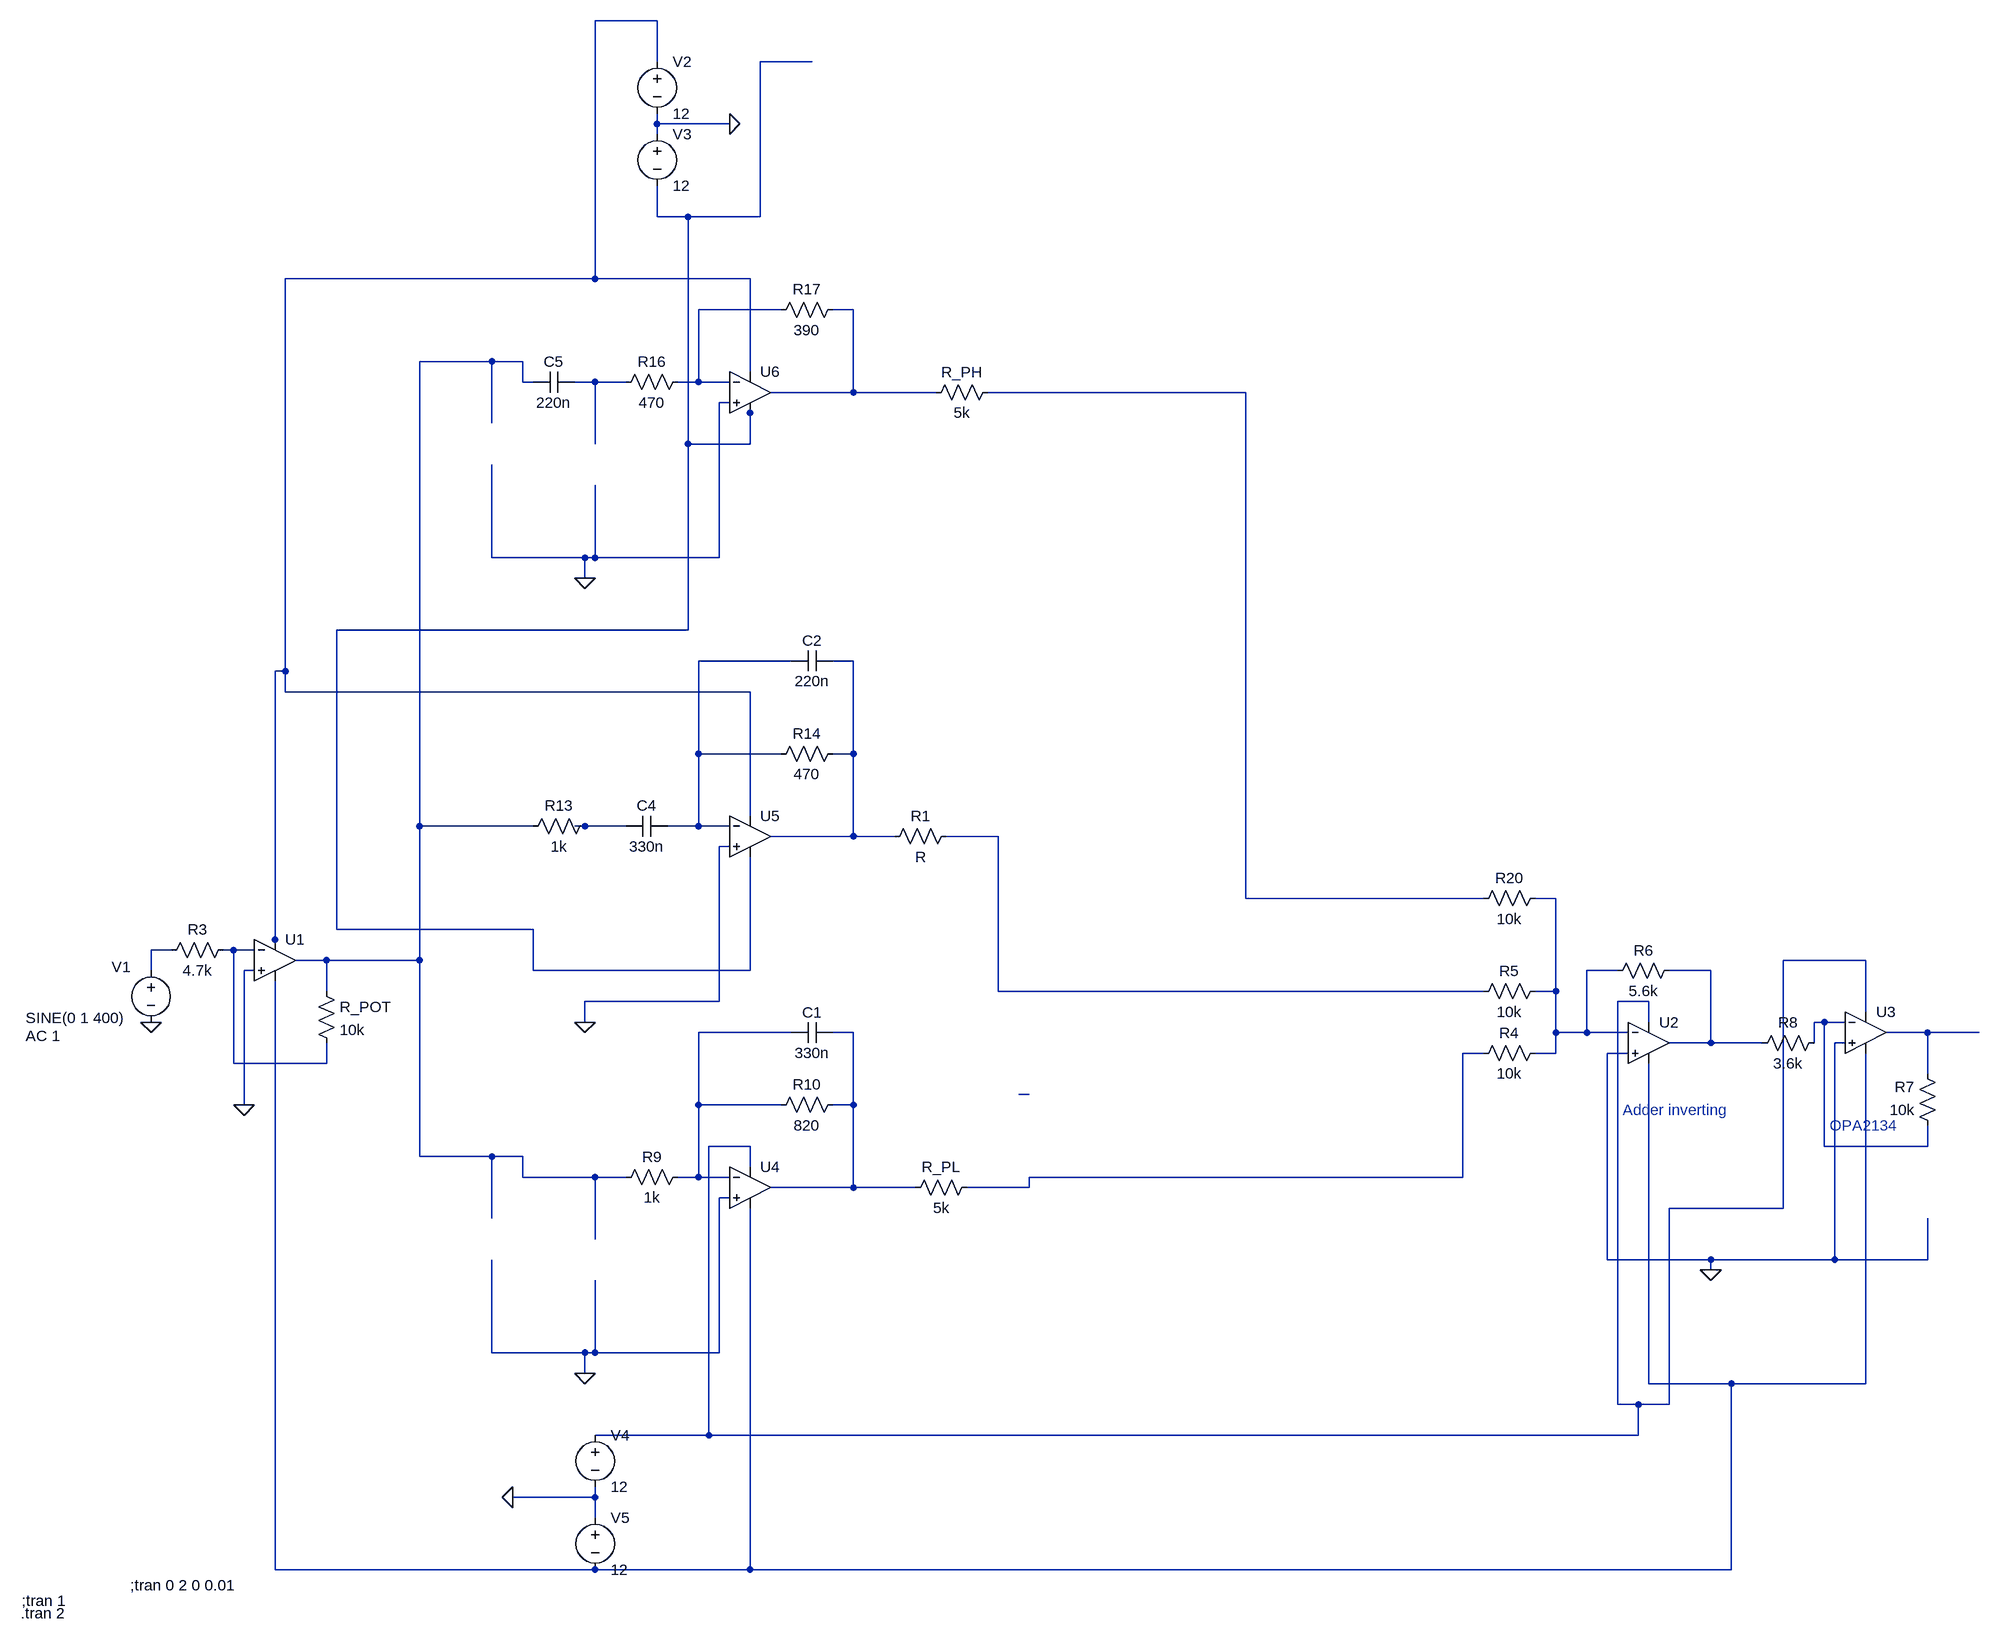
[diagram p0: schematic TheLastChanceBeforeSuicide.asc]
TheLastChanceBeforeSuicide.asc, the LTspice schematic file:
Version 4
SHEET 1 1940 1268
WIRE -112 -1216 -208 -1216
WIRE -112 -1152 -112 -1216
WIRE 128 -1152 48 -1152
WIRE -112 -1056 -112 -1072
WIRE 0 -1056 -112 -1056
WIRE -112 -1040 -112 -1056
WIRE -112 -912 -112 -960
WIRE -64 -912 -112 -912
WIRE 48 -912 48 -1152
WIRE 48 -912 -64 -912
WIRE -208 -816 -208 -1216
WIRE -208 -816 -688 -816
WIRE 32 -816 -208 -816
WIRE 80 -768 -48 -768
WIRE 192 -768 160 -768
WIRE -368 -688 -480 -688
WIRE -320 -688 -368 -688
WIRE 32 -672 32 -816
WIRE -320 -656 -320 -688
WIRE -304 -656 -320 -656
WIRE -208 -656 -240 -656
WIRE -160 -656 -208 -656
WIRE -48 -656 -48 -768
WIRE -48 -656 -80 -656
WIRE 0 -656 -48 -656
WIRE 192 -640 192 -768
WIRE 192 -640 64 -640
WIRE 320 -640 192 -640
WIRE 800 -640 400 -640
WIRE 0 -624 -16 -624
WIRE 32 -608 32 -624
WIRE -368 -592 -368 -688
WIRE -208 -560 -208 -656
WIRE -64 -560 -64 -912
WIRE 32 -560 32 -608
WIRE 32 -560 -64 -560
WIRE -368 -384 -368 -528
WIRE -224 -384 -368 -384
WIRE -208 -384 -208 -496
WIRE -208 -384 -224 -384
WIRE -16 -384 -16 -624
WIRE -16 -384 -208 -384
WIRE -224 -352 -224 -384
WIRE -64 -272 -64 -560
WIRE -64 -272 -608 -272
WIRE 96 -224 -48 -224
WIRE 192 -224 160 -224
WIRE -688 -208 -688 -816
WIRE -688 -208 -704 -208
WIRE -688 -176 -688 -208
WIRE 32 -176 -688 -176
WIRE -48 -80 -48 -224
WIRE 80 -80 -48 -80
WIRE 192 -80 192 -224
WIRE 192 -80 160 -80
WIRE 32 16 32 -176
WIRE -480 32 -480 -688
WIRE -304 32 -480 32
WIRE -224 32 -240 32
WIRE -160 32 -224 32
WIRE -48 32 -48 -80
WIRE -48 32 -96 32
WIRE 0 32 -48 32
WIRE 192 48 192 -80
WIRE 192 48 64 48
WIRE 256 48 192 48
WIRE 416 48 336 48
WIRE 0 64 -16 64
WIRE 800 144 800 -640
WIRE 1168 144 800 144
WIRE 1280 144 1248 144
WIRE -608 192 -608 -272
WIRE -304 192 -608 192
WIRE -704 208 -704 -208
WIRE -864 224 -896 224
WIRE -768 224 -784 224
WIRE -736 224 -768 224
WIRE -704 224 -704 208
WIRE -624 240 -672 240
WIRE -480 240 -480 32
WIRE -480 240 -624 240
WIRE 1760 240 1632 240
WIRE -896 256 -896 224
WIRE -736 256 -752 256
WIRE -304 256 -304 192
WIRE 32 256 32 80
WIRE 32 256 -304 256
WIRE 1376 256 1328 256
WIRE 1520 256 1456 256
WIRE -624 288 -624 240
WIRE 416 288 416 48
WIRE 1168 288 416 288
WIRE 1280 288 1280 144
WIRE 1280 288 1248 288
WIRE -16 304 -16 64
WIRE -16 304 -224 304
WIRE 1424 304 1376 304
WIRE 1760 320 1760 240
WIRE -224 336 -224 304
WIRE 1424 336 1424 304
WIRE 1696 336 1680 336
WIRE 1728 336 1696 336
WIRE 96 352 -48 352
WIRE 192 352 160 352
WIRE 1280 352 1280 288
WIRE 1328 352 1328 256
WIRE 1328 352 1280 352
WIRE 1392 352 1328 352
WIRE 1856 352 1792 352
WIRE 1936 352 1856 352
WIRE 1520 368 1520 256
WIRE 1520 368 1456 368
WIRE 1600 368 1520 368
WIRE 1680 368 1680 336
WIRE 1728 368 1712 368
WIRE 1168 384 1136 384
WIRE 1280 384 1280 352
WIRE 1280 384 1248 384
WIRE 1392 384 1360 384
WIRE -768 400 -768 224
WIRE -624 400 -624 368
WIRE -624 400 -768 400
WIRE 1856 416 1856 352
WIRE 464 448 448 448
WIRE -752 464 -752 256
WIRE -48 464 -48 352
WIRE 80 464 -48 464
WIRE 192 464 192 352
WIRE 192 464 160 464
WIRE 32 528 -32 528
WIRE 1696 528 1696 336
WIRE 1856 528 1856 496
WIRE 1856 528 1696 528
WIRE -480 544 -480 240
WIRE -368 544 -480 544
WIRE -320 544 -368 544
WIRE 32 560 32 528
WIRE -320 576 -320 544
WIRE -208 576 -320 576
WIRE -160 576 -208 576
WIRE -48 576 -48 464
WIRE -48 576 -80 576
WIRE 0 576 -48 576
WIRE 1136 576 1136 384
WIRE 1136 576 464 576
WIRE 192 592 192 464
WIRE 192 592 64 592
WIRE 288 592 192 592
WIRE 464 592 464 576
WIRE 464 592 368 592
WIRE 0 608 -16 608
WIRE 1632 624 1632 240
WIRE 1632 624 1456 624
WIRE -368 640 -368 544
WIRE -208 672 -208 576
WIRE 1360 704 1360 384
WIRE 1520 704 1360 704
WIRE 1712 704 1712 368
WIRE 1712 704 1520 704
WIRE 1856 704 1856 640
WIRE 1856 704 1712 704
WIRE 1520 720 1520 704
WIRE -368 848 -368 704
WIRE -224 848 -368 848
WIRE -208 848 -208 736
WIRE -208 848 -224 848
WIRE -16 848 -16 608
WIRE -16 848 -208 848
WIRE -224 880 -224 848
WIRE 1424 896 1424 400
WIRE 1552 896 1424 896
WIRE 1760 896 1760 384
WIRE 1760 896 1552 896
WIRE 1376 928 1376 304
WIRE 1408 928 1376 928
WIRE 1456 928 1456 624
WIRE 1456 928 1408 928
WIRE -32 976 -32 528
WIRE -32 976 -208 976
WIRE 1408 976 1408 928
WIRE 1408 976 -32 976
WIRE -208 1072 -208 1056
WIRE -208 1072 -336 1072
WIRE -208 1104 -208 1072
WIRE -704 1184 -704 272
WIRE -208 1184 -704 1184
WIRE 32 1184 32 624
WIRE 32 1184 -208 1184
WIRE 1552 1184 1552 896
WIRE 1552 1184 32 1184
FLAG -224 880 0
FLAG -896 336 0
FLAG 0 -1056 0
FLAG -336 1072 0
FLAG 1520 720 0
FLAG -224 336 0
FLAG -224 -352 0
FLAG -752 464 0
SYMBOL Opamps\\UniversalOpamp2 -704 240 R0
SYMATTR InstName U1
SYMBOL res -640 272 R0
SYMATTR InstName R_POT
SYMATTR Value 10k
SYMBOL res -768 208 R90
WINDOW 0 0 56 VBottom 2
WINDOW 3 32 56 VTop 2
SYMATTR InstName R3
SYMATTR Value 4.7k
SYMBOL voltage -896 240 R0
WINDOW 123 -194 117 Left 2
WINDOW 39 0 0 Left 2
WINDOW 0 -61 10 Left 2
WINDOW 3 -194 89 Left 2
SYMATTR Value2 AC 1
SYMATTR InstName V1
SYMATTR Value SINE(0 1 400)
SYMBOL voltage -112 -1168 R0
WINDOW 123 0 0 Left 2
WINDOW 39 0 0 Left 2
SYMATTR InstName V2
SYMATTR Value 12
SYMBOL voltage -112 -1056 R0
WINDOW 123 0 0 Left 2
WINDOW 39 0 0 Left 2
SYMATTR InstName V3
SYMATTR Value 12
SYMBOL voltage -208 960 R0
WINDOW 123 0 0 Left 2
WINDOW 39 0 0 Left 2
SYMATTR InstName V4
SYMATTR Value 12
SYMBOL voltage -208 1088 R0
WINDOW 123 0 0 Left 2
WINDOW 39 0 0 Left 2
SYMATTR InstName V5
SYMATTR Value 12
SYMBOL Opamps\\UniversalOpamp2 1424 368 R0
SYMATTR InstName U2
SYMBOL res 1264 368 R90
WINDOW 0 0 56 VBottom 2
WINDOW 3 32 56 VTop 2
SYMATTR InstName R4
SYMATTR Value 10k
SYMBOL res 1264 272 R90
WINDOW 0 0 56 VBottom 2
WINDOW 3 32 56 VTop 2
SYMATTR InstName R5
SYMATTR Value 10k
SYMBOL res 1360 272 R270
WINDOW 0 32 56 VTop 2
WINDOW 3 0 56 VBottom 2
SYMATTR InstName R6
SYMATTR Value 5.6k
SYMBOL Opamps\\UniversalOpamp2 1760 352 R0
SYMATTR InstName U3
SYMBOL res 1872 512 R180
WINDOW 0 36 76 Left 2
WINDOW 3 36 40 Left 2
SYMATTR InstName R7
SYMATTR Value 10k
SYMBOL res 1584 384 R270
WINDOW 0 32 56 VTop 2
WINDOW 3 0 56 VBottom 2
SYMATTR InstName R8
SYMATTR Value 3.6k
SYMBOL Opamps\\UniversalOpamp2 32 592 R0
SYMATTR InstName U4
SYMBOL res -64 560 R90
WINDOW 0 0 56 VBottom 2
WINDOW 3 32 56 VTop 2
SYMATTR InstName R9
SYMATTR Value 1k
SYMBOL res 176 448 R90
WINDOW 0 0 56 VBottom 2
WINDOW 3 32 56 VTop 2
SYMATTR InstName R10
SYMATTR Value 820
SYMBOL Opamps\\UniversalOpamp2 32 48 R0
SYMATTR InstName U5
SYMBOL res -208 16 R90
WINDOW 0 0 56 VBottom 2
WINDOW 3 32 56 VTop 2
SYMATTR InstName R13
SYMATTR Value 1k
SYMBOL res 176 -96 R90
WINDOW 0 0 56 VBottom 2
WINDOW 3 32 56 VTop 2
SYMATTR InstName R14
SYMATTR Value 470
SYMBOL cap -96 16 R90
WINDOW 0 0 32 VBottom 2
WINDOW 3 32 32 VTop 2
SYMATTR InstName C4
SYMATTR Value 330n
SYMBOL Opamps\\UniversalOpamp2 32 -640 R0
SYMATTR InstName U6
SYMBOL res -64 -672 R90
WINDOW 0 0 56 VBottom 2
WINDOW 3 32 56 VTop 2
SYMATTR InstName R16
SYMATTR Value 470
SYMBOL res 176 -784 R90
WINDOW 0 0 56 VBottom 2
WINDOW 3 32 56 VTop 2
SYMATTR InstName R17
SYMATTR Value 390
SYMBOL cap -240 -672 R90
WINDOW 0 0 32 VBottom 2
WINDOW 3 32 32 VTop 2
SYMATTR InstName C5
SYMATTR Value 220n
SYMBOL res 1264 128 R90
WINDOW 0 0 56 VBottom 2
WINDOW 3 32 56 VTop 2
SYMATTR InstName R20
SYMATTR Value 10k
SYMBOL cap 160 336 R90
WINDOW 0 0 32 VBottom 2
WINDOW 3 32 32 VTop 2
SYMATTR InstName C1
SYMATTR Value 330n
SYMBOL res 384 576 R90
WINDOW 0 0 56 VBottom 2
WINDOW 3 32 56 VTop 2
SYMATTR InstName R_PL
SYMATTR Value 5k
SYMBOL res 416 -656 R90
WINDOW 0 0 56 VBottom 2
WINDOW 3 32 56 VTop 2
SYMATTR InstName R_PH
SYMATTR Value 5k
SYMBOL cap 160 -240 R90
WINDOW 0 0 32 VBottom 2
WINDOW 3 32 32 VTop 2
SYMATTR InstName C2
SYMATTR Value 220n
SYMBOL res 352 32 R90
WINDOW 0 0 56 VBottom 2
WINDOW 3 32 56 VTop 2
SYMATTR InstName R1
TEXT -928 1208 Left 2 !;tran 0 2 0 0.01
TEXT 1704 496 Left 2 ;OPA2134
TEXT 1384 472 Left 2 ;Adder inverting
TEXT -1096 1232 Left 2 !;tran 1
TEXT -1098 1252 Left 2 !.tran 2

The netlist it stands for:
* TheLastChanceBeforeSuicide.asc
XU1 0 N014 N001 N023 N005 level.2 Avol=1Meg GBW=10Meg Slew=10Meg ilimit=25m rail=0 Vos=0 phimargin=45 en=0 enk=0 in=0 ink=0 Rin=500Meg  ; pins IN+ IN- V+ V- OUT
R_POT N005 N014 10k
R3 N014 N013 4.7k
V1 N013 0 SINE(0 1 400) AC 1
V2 N001 0 12
V3 0 N002 12
V4 N015 0 12
V5 0 N023 12
XU2 0 N012 N015 N023 N016 level.2 Avol=1Meg GBW=10Meg Slew=10Meg ilimit=25m rail=0 Vos=0 phimargin=45 en=0 enk=0 in=0 ink=0 Rin=500Meg  ; pins IN+ IN- V+ V- OUT
R4 N012 N021 10k
R5 N012 N011 10k
R6 N012 N016 5.6k
XU3 0 N017 N015 N023 N020 level.2 Avol=1Meg GBW=10Meg Slew=10Meg ilimit=25m rail=0 Vos=0 phimargin=45 en=0 enk=0 in=0 ink=0 Rin=500Meg  ; pins IN+ IN- V+ V- OUT
R7 N017 N020 10k
R8 N016 N017 3.6k
XU4 0 N018 N015 N023 N019 level.2 Avol=1Meg GBW=10Meg Slew=10Meg ilimit=25m rail=0 Vos=0 phimargin=45 en=0 enk=0 in=0 ink=0 Rin=500Meg  ; pins IN+ IN- V+ V- OUT
R9 N018 N005 1k
R10 N019 N018 820
XU5 0 N008 N001 N002 N009 level.2 Avol=1Meg GBW=10Meg Slew=10Meg ilimit=25m rail=0 Vos=0 phimargin=45 en=0 enk=0 in=0 ink=0 Rin=500Meg  ; pins IN+ IN- V+ V- OUT
R13 N010 N005 1k
R14 N009 N008 470
C4 N008 N010 330n
XU6 0 N003 N001 N002 N004 level.2 Avol=1Meg GBW=10Meg Slew=10Meg ilimit=25m rail=0 Vos=0 phimargin=45 en=0 enk=0 in=0 ink=0 Rin=500Meg  ; pins IN+ IN- V+ V- OUT
R16 N003 N006 470
R17 N004 N003 390
C5 N006 N005 220n
R20 N012 N007 10k
C1 N019 N018 330n
R_PL N021 N019 5k
R_PH N007 N004 5k
C2 N009 N008 220n
R1 N011 N009 R
;tran 0 2 0 0.01
* OPA2134
* Adder inverting
;tran 1
.tran 2
.lib UniversalOpamps2.sub
.backanno
.end